# EAGLE design MOD-X_V10 (EAGLE 9.6.2)

## Sheet 1 of 2
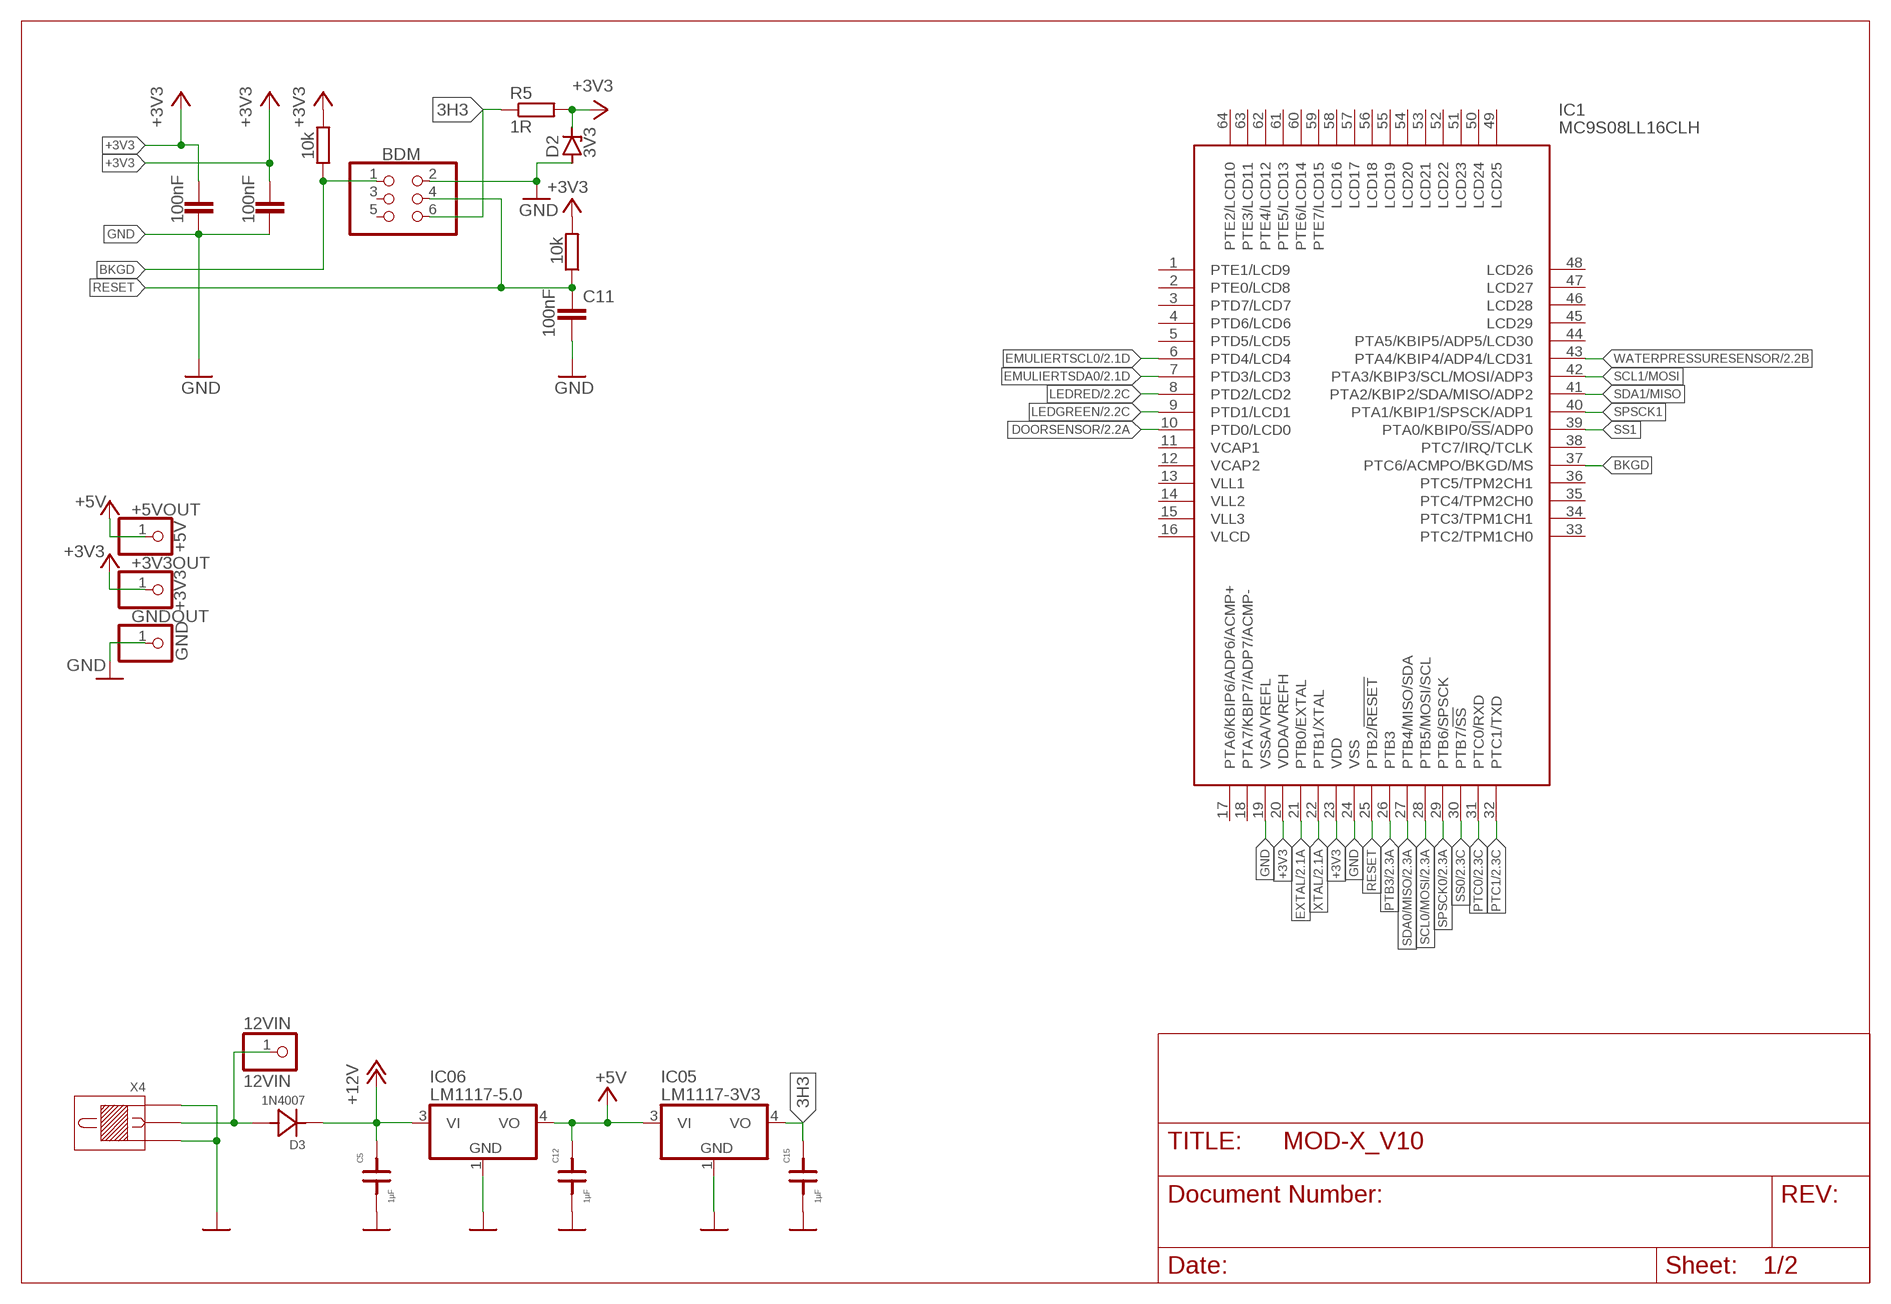
[diagram p0: schematic, sheet 1]

### Parts
12VIN  12VIN  PINHD-1X1  [1X01]
+3V3OUT  +3V3  PINHD-1X1  [1X01]
+5VOUT  +5V  PINHD-1X1  [1X01]
BDM  PINHD-2X3  [2X03]
C5  1µF  C1  [0805F]
C9  100nF  C-EUC0805  [C0805]
C10  100nF  C-EUC0805  [C0805]
C11  100nF  C-EUC0805  [C0805]
C12  1µF  C1  [0805F]
C15  1µF  C1  [0805F]
D2  3V3  ZENER-DIODESOD80C  [SOD80C]
D3  1N4007  DHCMELF  [MELF_B]
GNDOUT  GND  PINHD-1X1  [1X01]
IC1  MC9S08LL16CLH  [QFP50P1200X1200X160-64N]
IC05  LM1117-3V3  LM1117DT  [DPAK]
IC06  LM1117-5.0  LM1117DT  [DPAK]
R5  1R  R-EU_R0805  [R0805]
R16  10k  R-EU_R0805  [R0805]
R17  10k  R-EU_R0805  [R0805]
X4  SPP  [SPP]

### Nets
3H3: BDM.6 C15.2 IC05.4(VO) R5.1
+3V3: +3V3OUT.1 C9.1 C10.1 D2.C IC1.20(VDDA/VREFH) IC1.23(VDD) R5.2 R16.2 R17.2 ; also sheet 2
+5V: +5VOUT.1 C12.2 IC05.3(VI) IC06.4(VO) ; also sheet 2
+12V: C5.2 D3.K IC06.3(VI) ; also sheet 2
BKGD: BDM.1 IC1.37(PTC6/ACMPO/BKGD/MS) R16.1
DOORSENSOR: IC1.10(PTD0/LCD0) ; also sheet 2
EMULIERTSCL0: IC1.6(PTD4/LCD4) ; also sheet 2
EMULIERTSDA0: IC1.7(PTD3/LCD3) ; also sheet 2
EXTAL: IC1.21(PTB0/EXTAL) ; also sheet 2
GND: BDM.2 C5.1 C9.2 C10.2 C11.2 C12.1 C15.1 D2.A GNDOUT.1 IC1.19(VSSA/VREFL) IC1.24(VSS) IC05.1(GND) IC06.1(GND) X4.1 X4.3 ; also sheet 2
LEDGREEN: IC1.9(PTD1/LCD1) ; also sheet 2
LEDRED: IC1.8(PTD2/LCD2) ; also sheet 2
N$71: 12VIN.1 D3.A X4.2
PTB3: IC1.26(PTB3) ; also sheet 2
PTC0: IC1.31(PTC0/RXD) ; also sheet 2
PTC1: IC1.32(PTC1/TXD) ; also sheet 2
RESET: BDM.4 C11.1 IC1.25(PTB2/!RESET) R17.1
SCL0/MOSI: IC1.28(PTB5/MOSI/SCL) ; also sheet 2
SCL1/MOSI: IC1.42(PTA3/KBIP3/SCL/MOSI/ADP3)
SDA0/MISO: IC1.27(PTB4/MISO/SDA) ; also sheet 2
SDA1/MISO: IC1.41(PTA2/KBIP2/SDA/MISO/ADP2)
SPSCK0: IC1.29(PTB6/SPSCK) ; also sheet 2
SPSCK1: IC1.40(PTA1/KBIP1/SPSCK/ADP1)
SS0: IC1.30(PTB7/!SS) ; also sheet 2
SS1: IC1.39(PTA0/KBIP0/!SS!/ADP0)
WATERPRESSURESENSOR: IC1.43(PTA4/KBIP4/ADP4/LCD31) ; also sheet 2
XTAL: IC1.22(PTB1/XTAL) ; also sheet 2
Unconnected: BDM.3 BDM.5 IC1.1(PTE1/LCD9) IC1.2(PTE0/LCD8) IC1.3(PTD7/LCD7) IC1.4(PTD6/LCD6) IC1.5(PTD5/LCD5) IC1.11(VCAP1) IC1.12(VCAP2) IC1.13(VLL1) IC1.14(VLL2) IC1.15(VLL3) IC1.16(VLCD) IC1.17(PTA6/KBIP6/ADP6/ACMP+) IC1.18(PTA7/KBIP7/ADP7/ACMP-) IC1.33(PTC2/TPM1CH0) IC1.34(PTC3/TPM1CH1) IC1.35(PTC4/TPM2CH0) IC1.36(PTC5/TPM2CH1) IC1.38(PTC7/IRQ/TCLK) IC1.44(PTA5/KBIP5/ADP5/LCD30) IC1.45(LCD29) IC1.46(LCD28) IC1.47(LCD27) IC1.48(LCD26) IC1.49(LCD25) IC1.50(LCD24) IC1.51(LCD23) IC1.52(LCD22) IC1.53(LCD21) IC1.54(LCD20) IC1.55(LCD19) IC1.56(LCD18) IC1.57(LCD17) IC1.58(LCD16) IC1.59(PTE7/LCD15) IC1.60(PTE6/LCD14) IC1.61(PTE5/LCD13) IC1.62(PTE4/LCD12) IC1.63(PTE3/LCD11) IC1.64(PTE2/LCD10)

## Sheet 2 of 2
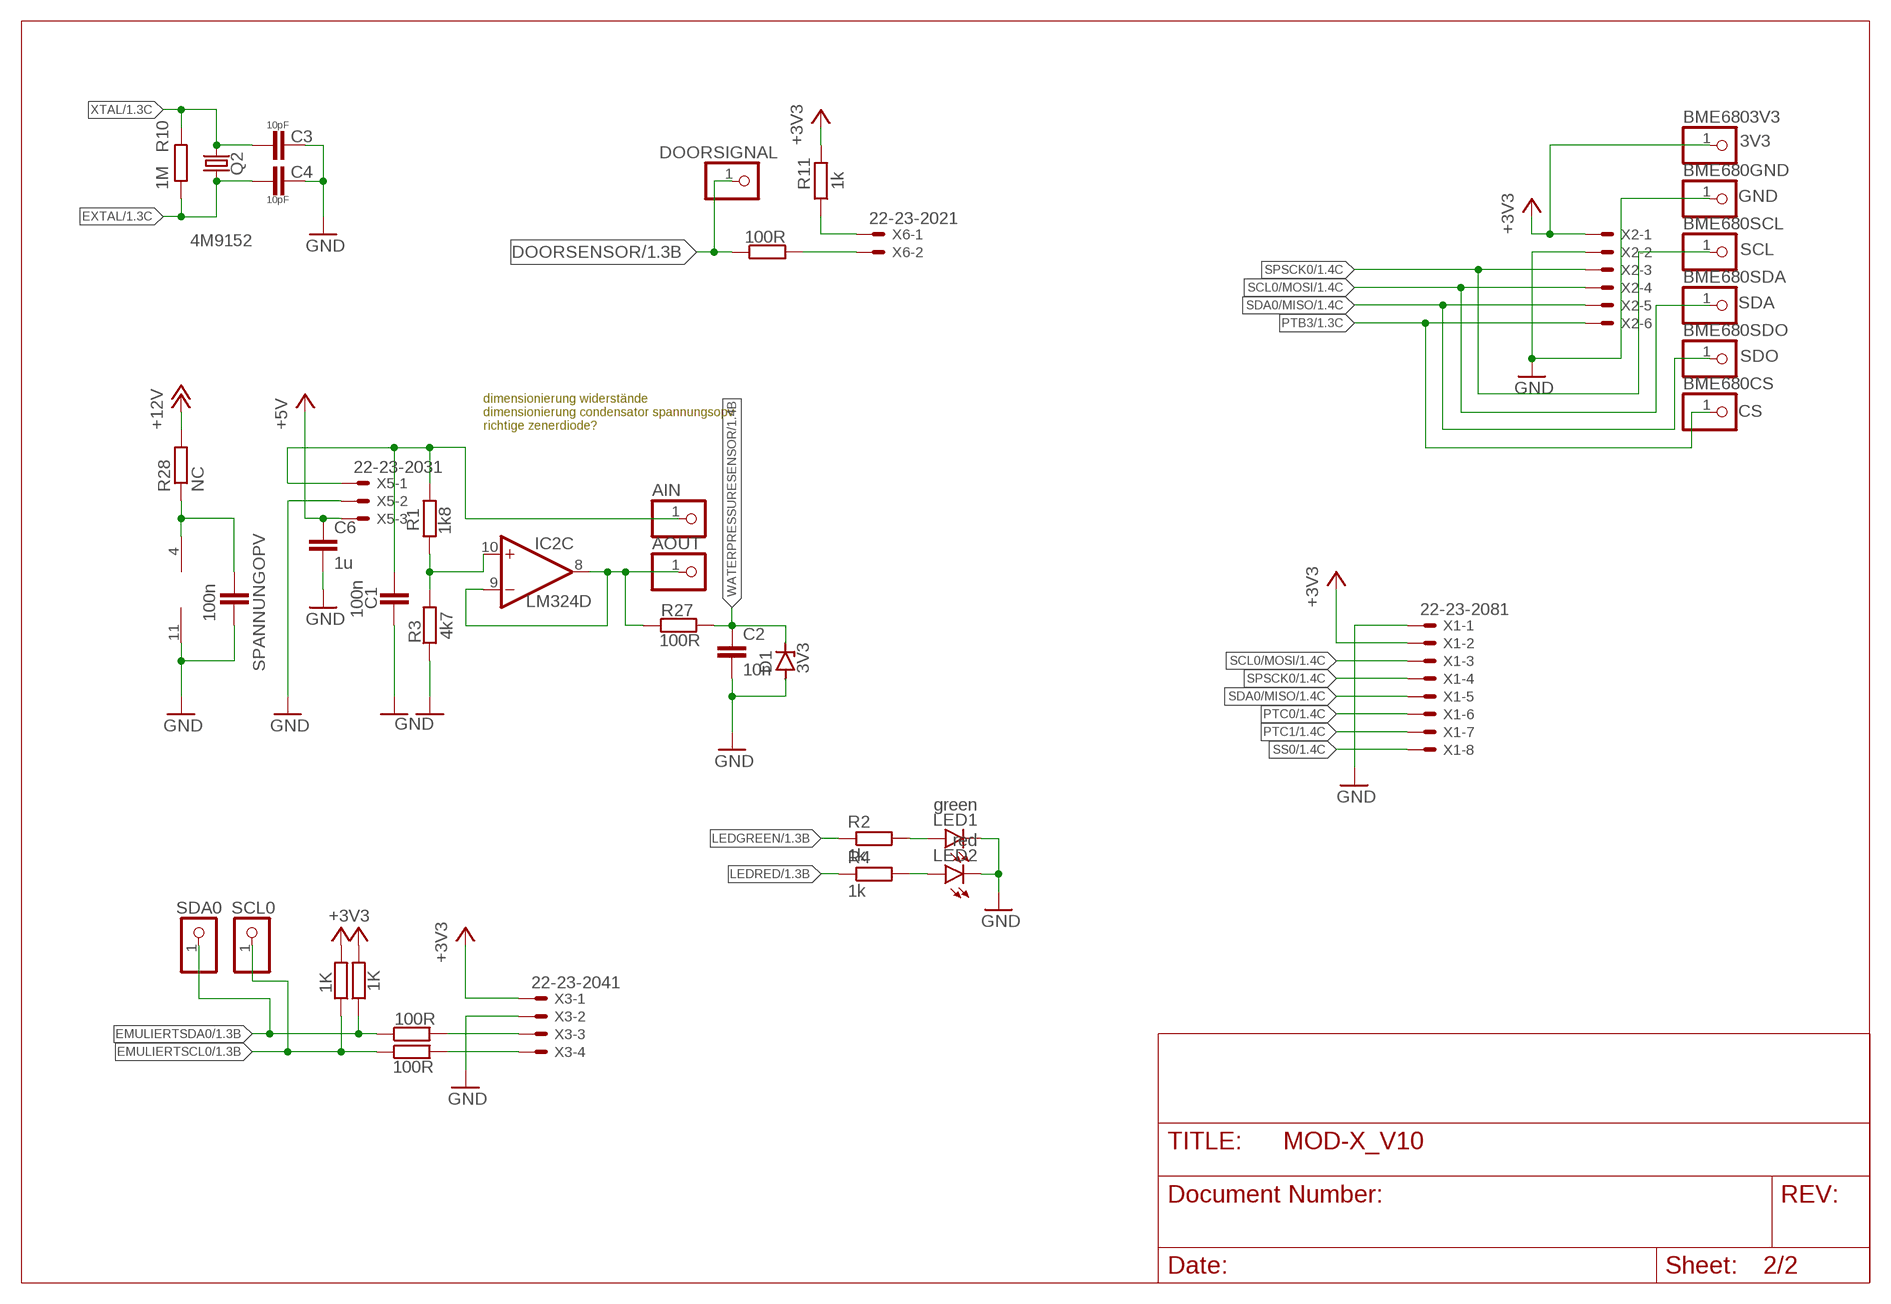
[diagram p1: schematic, sheet 2]

### Parts
AIN  PINHD-1X1  [1X01]
AOUT  PINHD-1X1  [1X01]
BME680CS  CS  PINHD-1X1  [1X01]
BME680GND  GND  PINHD-1X1  [1X01]
BME680SCL  SCL  PINHD-1X1  [1X01]
BME680SDA  SDA  PINHD-1X1  [1X01]
BME680SDO  SDO  PINHD-1X1  [1X01]
BME6803V3  3V3  PINHD-1X1  [1X01]
C1  100n  C-EUC0805  [C0805]
C2  10n  C-EUC0805  [C0805]
C3  10pF  C-EUC0805  [C0805]
C4  10pF  C-EUC0805  [C0805]
C6  1u  C-EUC0805  [C0805]
D1  3V3  ZENER-DIODESOD80C  [SOD80C]
DOORSIGNAL  PINHD-1X1  [1X01]
IC2  LM324D  [SO14]
LED1  green  LEDCHIP-LED0805  [CHIP-LED0805]
LED2  red  LEDCHIP-LED0805  [CHIP-LED0805]
Q2  4M9152  CRYSTALHC49UP  [HC49UP]
R1  1k8  R-EU_R0805  [R0805]
R2  1k  R-EU_R0805  [R0805]
R3  4k7  R-EU_R0805  [R0805]
R4  1k  R-EU_R0805  [R0805]
R6  100R  R-EU_R0805  [R0805]
R7  100R  R-EU_R0805  [R0805]
R8  100R  R-EU_R0805  [R0805]
R9  1K  R-EU_R0805  [R0805]
R10  1M  R-EU_R0805  [R0805]
R11  1k  R-EU_R0805  [R0805]
R18  1K  R-EU_R0805  [R0805]
R27  100R  R-EU_R0805  [R0805]
R28  NC  R-EU_R0805  [R0805]
SCL0  PINHD-1X1  [1X01]
SDA0  PINHD-1X1  [1X01]
SPANNUNGOPV  100n  C-EUC0805  [C0805]
X1  22-23-2081  [22-23-2081]
X2  22-23-2061  [22-23-2061]
X3  22-23-2041  [22-23-2041]
X5  22-23-2031  [22-23-2031]
X6  22-23-2021  [22-23-2021]

### Nets
+3V3: BME6803V3.1 R9.2 R11.2 R18.2 X1.2 X2.1 X3.1 ; also sheet 1
+5V: C6.1 X5.3 ; also sheet 1
+12V: R28.2 ; also sheet 1
DOORSENSOR: DOORSIGNAL.1 R6.1 ; also sheet 1
EMULIERTSCL0: R8.1 R18.1 SCL0.1 ; also sheet 1
EMULIERTSDA0: R7.1 R9.1 SDA0.1 ; also sheet 1
EXTAL: C4.1 Q2.1 R10.1 ; also sheet 1
GND: BME680GND.1 C1.2 C2.2 C3.2 C4.2 C6.2 D1.A IC2.11(P:V-) LED1.C LED2.C R3.1 SPANNUNGOPV.2 X1.1 X2.2 X3.2 X5.2 ; also sheet 1
LEDGREEN: R2.1 ; also sheet 1
LEDRED: R4.1 ; also sheet 1
N$2: IC2.10(C:+IN) R1.1 R3.2
N$3: AIN.1 C1.1 R1.2 X5.1
N$4: R6.2 X6.2
N$6: R11.1 X6.1
N$7: IC2.4(P:V+) R28.1 SPANNUNGOPV.1
N$9: LED1.A R2.2
N$10: R8.2 X3.4
N$11: R7.2 X3.3
N$12: LED2.A R4.2
N$21: AOUT.1 IC2.8(C:OUT) IC2.9(C:-IN) R27.1
PTB3: BME680CS.1 X2.6 ; also sheet 1
PTC0: X1.6 ; also sheet 1
PTC1: X1.7 ; also sheet 1
SCL0/MOSI: BME680SDA.1 X1.3 X2.4 ; also sheet 1
SDA0/MISO: BME680SDO.1 X1.5 X2.5 ; also sheet 1
SPSCK0: BME680SCL.1 X1.4 X2.3 ; also sheet 1
SS0: X1.8 ; also sheet 1
WATERPRESSURESENSOR: C2.1 D1.C R27.2 ; also sheet 1
XTAL: C3.1 Q2.2 R10.2 ; also sheet 1
Unconnected: IC2.1(A:OUT) IC2.2(A:-IN) IC2.3(A:+IN) IC2.5(B:+IN) IC2.6(B:-IN) IC2.7(B:OUT) IC2.12(D:+IN) IC2.13(D:-IN) IC2.14(D:OUT)

### Notes on the sheet
- dimensionierung widerstände
  dimensionierung condensator spannungsopv
  richtige zenerdiode?

## Library data of the parts
12VIN +3V3OUT +5VOUT AIN AOUT BME680CS BME680GND BME680SCL BME680SDA BME680SDO BME6803V3 DOORSIGNAL GNDOUT SCL0 SDA0 = pinhead:PINHD-1X1: PIN HEADER
BDM = pinhead:PINHD-2X3: PIN HEADER
C1-C4 C6 C9-C11 SPANNUNGOPV = rcl:C-EU: CAPACITOR, European symbol; SPICEPREFIX: C
C5 C12 C15 = deto:C
D1 D2 = diode:ZENER-DIODE: Z-Diode
D3 = deto:DHC: Hii-Curr-Diode, Silizium, Typ Gleichrichter z.B. wie 1N4007 oder ähnlich
IC1 = MC9S08LL16CLH:MC9S08LL16CLH: MCU 8-bit S08 CISC 16KB Flash 2.5V/3.3V 64-Pin LQFP Tray Source: Datasheet <http://www.nxp.com/docs/en/data-sheet/MC9S08LL16.pdf>; ARROW_PART_NUMBER: MC9S08LL16CLH; ARROW_PRICE-STOCK: https://www.arrow.com/en/products/mc9s08ll16clh/nxp-semiconductors; DESCRIPTION: MCU 8-bit S08 CISC 16KB Flash 2.5V/3.3V 64-Pin LQFP Tray; HEIGHT: 1.6mm; MANUFACTURER_NAME: NXP; MANUFACTURER_PART_NUMBER: MC9S08LL16CLH; MOUSER_PART_NUMBER: 841-MC9S08LL16CLH; MOUSER_PRICE-STOCK: https://www.mouser.com/Search/Refine.aspx?Keyword=841-MC9S08LL16CLH
IC2 = linear:LM324: OP AMP
IC05 IC06 = deto:LM1117: Spannungsregler Fix oder einstellbar LM1117XX-YY wobei XX die Gehäuseform angibt (DT = Dpak) und YY die Spannung angibt (z.B. 5.0 für 5V oder ADJ für einstellbar)
LED1 LED2 = led:LED: LED OSRAM: - CHIPLED LG R971, LG N971, LY N971, LG Q971, LY Q971, LO R971, LY R971 LH N974, LH R974 LS Q976, LO Q976, LY Q976 LO Q996 - Hyper CHIPLED LW Q18S LB Q993, LB Q99A, LB R99A - SideLED LS A670, LO A670, LY A670, LG A670, LP A670 LB A673, LV A673, LT A673, LW A673 LH A674 LY A675 LS A676, LA A676, LO A676, LY A676, LW A676 LS A679, LY A679, LG A679 - Hyper Micro SIDELED® LS Y876, LA Y876, LO Y876, LY Y876 LT Y87S - SmartLED LW L88C, LW L88S LB L89C, LB L89S, LG L890 LS L89K, LO L89K, LY L89K LS L896, LA L896, LO L896, LY L896 - TOPLED LS T670, LO T670, LY T670, LG T670, LP T670 LSG T670, LSP T670, LSY T670, LOP T670, LYG T670 LG T671, LOG T671, LSG T671 LB T673, LV T673, LT T673, LW T673 LH T674 LS T676, LA T676, LO T676, LY T676, LB T676, LH T676, LSB T676, LW T676 LB T67C, LV T67C, LT T67C, LS T67K, LO T67K, LY T67K, LW E67C LS E67B, LA E67B, LO E67B, LY E67B, LB E67C, LV E67C, LT E67C LW T67C LS T679, LY T679, LG T679 LS T770, LO T770, LY T770, LG T770, LP T770 LB T773, LV T773, LT T773, LW T773 LH T774 LS E675, LA E675, LY E675, LS T675 LS T776, LA T776, LO T776, LY T776, LB T776 LHGB T686 LT T68C, LB T68C - Hyper Mini TOPLED® LB M676 - Mini TOPLED Santana® LG M470 LS M47K, LO M47K, LY M47K Source: http://www.osram.convergy.de LUXEON: - LUMILED® LXK2-PW12-R00, LXK2-PW12-S00, LXK2-PW14-U00, LXK2-PW14-V00 LXK2-PM12-R00, LXK2-PM12-S00, LXK2-PM14-U00 LXK2-PE12-Q00, LXK2-PE12-R00, LXK2-PE12-S00, LXK2-PE14-T00, LXK2-PE14-U00 LXK2-PB12-K00, LXK2-PB12-L00, LXK2-PB12-M00, LXK2-PB14-N00, LXK2-PB14-P00, LXK2-PB14-Q00 LXK2-PR12-L00, LXK2-PR12-M00, LXK2-PR14-Q00, LXK2-PR14-R00 LXK2-PD12-Q00, LXK2-PD12-R00, LXK2-PD12-S00 LXK2-PH12-R00, LXK2-PH12-S00 LXK2-PL12-P00, LXK2-PL12-Q00, LXK2-PL12-R00 Source: www.luxeon.com KINGBRIGHT: KA-3528ASYC Source: www.kingbright.com
Q2 = crystal:CRYSTAL: CRYSTAL; OC_FARNELL: unknown; OC_NEWARK: unknown
R1-R11 R16-R18 R27 R28 = rcl:R-EU_: RESISTOR, European symbol; SPICEPREFIX: R
X1 = con-molex:22-23-2081: .100" (2.54mm) Center Header - 8 Pin; MF: MOLEX; MPN: 22-23-2081; OC_FARNELL: 1756826; OC_NEWARK: 01C7592
X2 = con-molex:22-23-2061: .100" (2.54mm) Center Header - 6 Pin; MF: MOLEX; MPN: 22-23-2061; OC_FARNELL: 1462922; OC_NEWARK: 27C1933
X3 = con-molex:22-23-2041: .100" (2.54mm) Center Header - 4 Pin; MF: MOLEX; MPN: 22-23-2041; OC_FARNELL: 1462920; OC_NEWARK: 38C0355
X4 = CONNECT:SPP
X5 = con-molex:22-23-2031: .100" (2.54mm) Center Header - 3 Pin; MF: MOLEX; MPN: 22-23-2031; OC_FARNELL: 1462950; OC_NEWARK: 30C0862
X6 = con-molex:22-23-2021: .100" (2.54mm) Center Header - 2 Pin; MF: MOLEX; MPN: 22-23-2021; OC_FARNELL: 1462926; OC_NEWARK: 25C3832

## Board
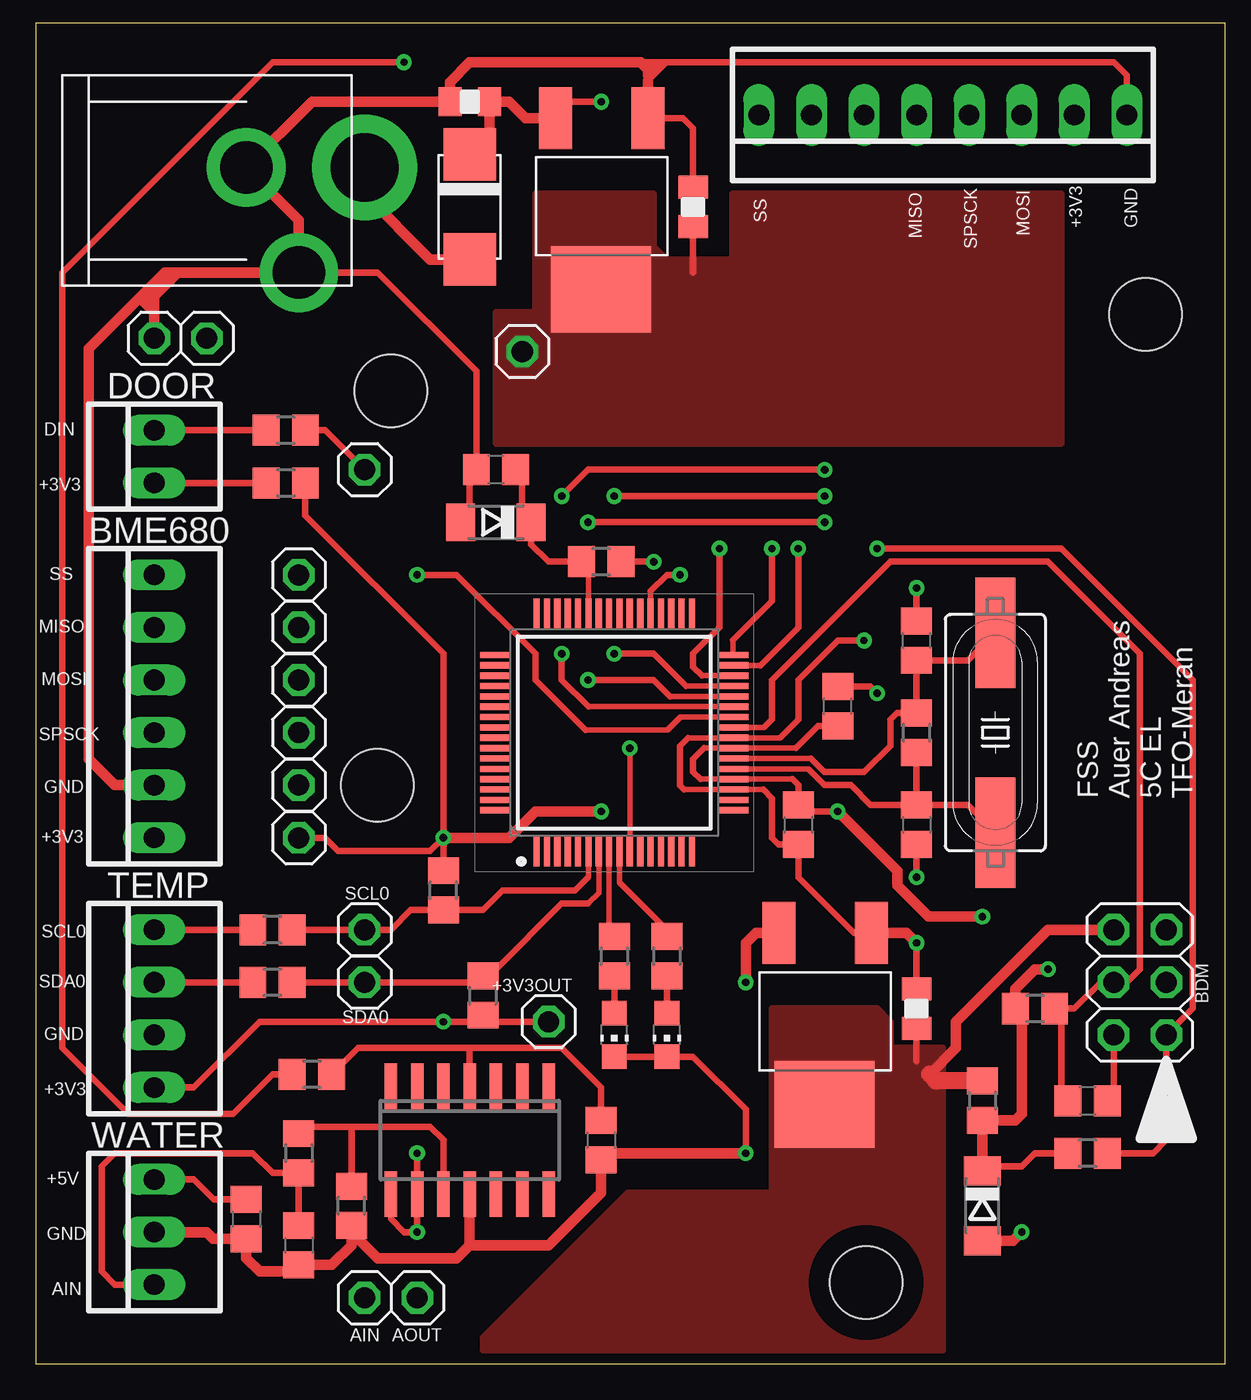
[diagram p2: board, top side]
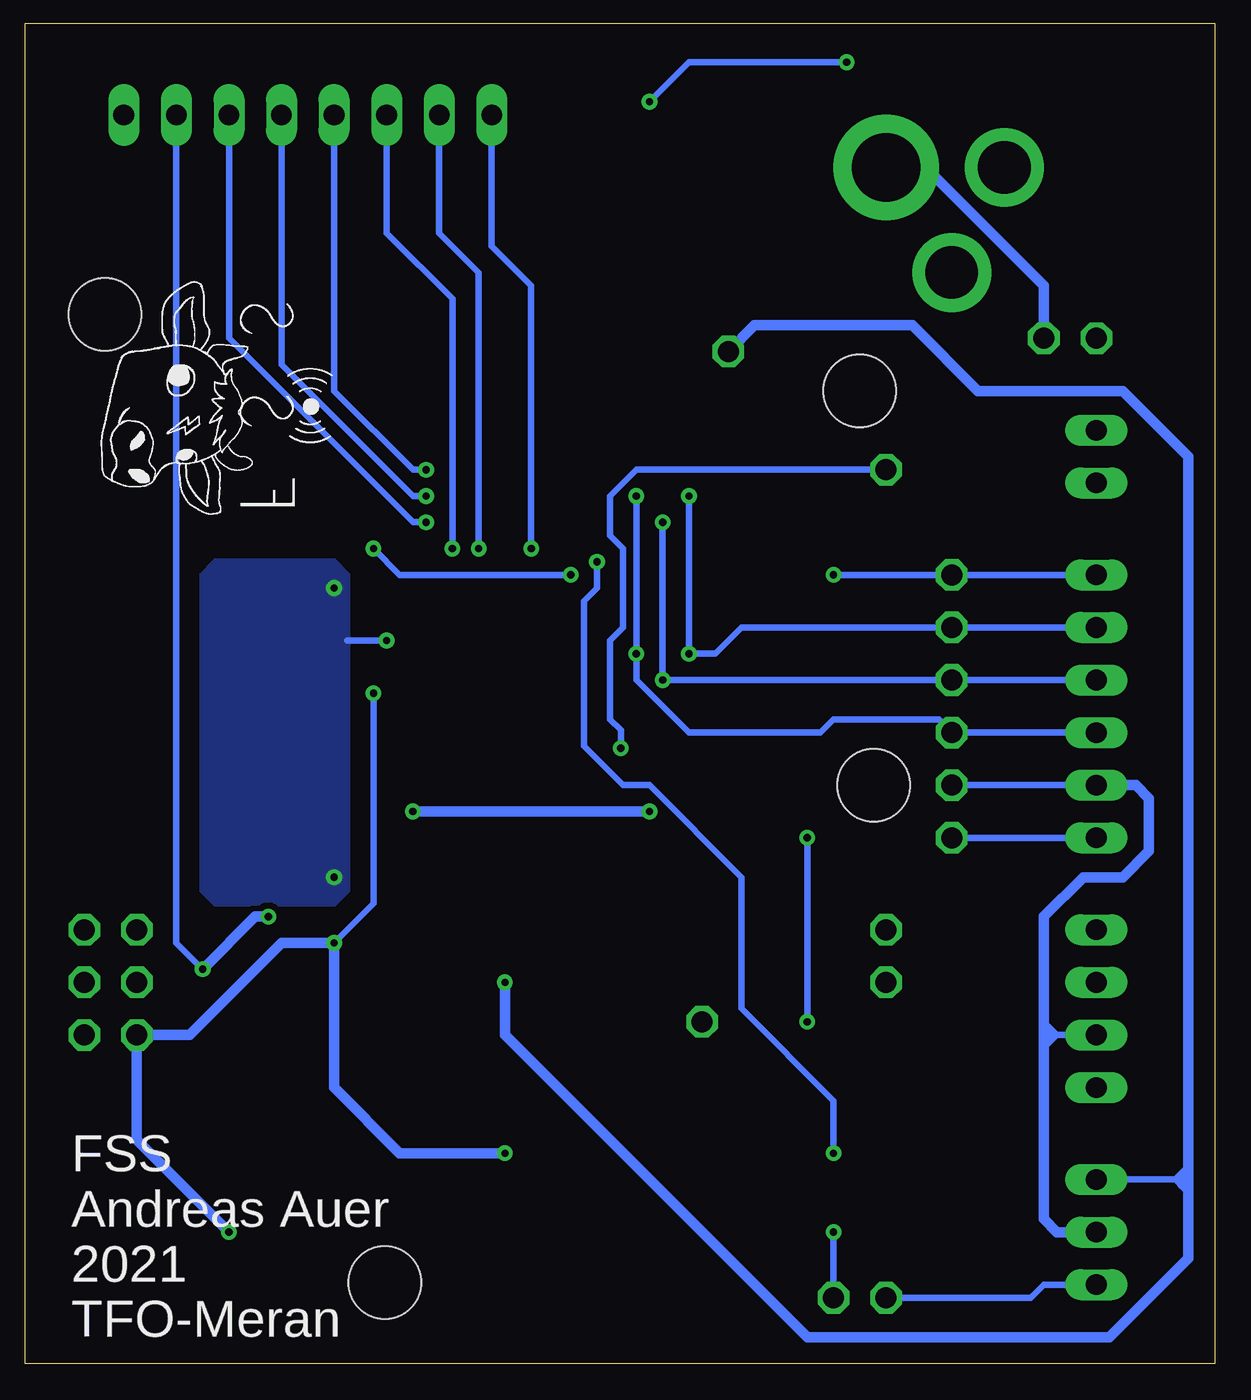
[diagram p3: board, bottom side, seen from below]

No outline drawn. Coordinates in mm, seen from the top.
Copper layers (1*16): Top 0.035mm / dielectric 1.5mm / Bottom 0.035mm
Design rules "default *": minimum track width 6mil, minimum drill 0.35mm, track to track 12mil, track to pad 12mil, pad to pad 12mil, via to via 12mil, smd to smd 12mil, copper to edge 40mil, drill to drill 12mil, minimum pad ring 10mil, minimum via ring 8mil, stop-mask expansion 4mil, vias tented up to drill 0mil, thermal gap 10mil
Holes 3.5 mm at 16.48,27.94 53.62,50.69 17.14,46.99 40.1,3.92
Milling: 4 lines

### Footprints (pad centres in the part's own frame; a part is rotated, then mirrored left to right if it is on the bottom)
1X01 = drill 1.016 octagon: 1 0,0
2X03 = drill 1.016 octagon: 1 -2.54,-1.27; 2 -2.54,1.27; 3 0,-1.27; 4 0,1.27; 5 2.54,-1.27; 6 2.54,1.27
C0805 = smd 1.3 x 1.5: 1 -0.95,0; 2 0.95,0
0805F = smd 1.118 x 1.422: 1 -0.953,0; 2 0.953,0
SOD80C = smd 1.4 x 1.8: A 1.7,0; C -1.7,0
MELF_B = smd 2.54 x 2.54: A 2.54,0; K -2.54,0
QFP50P1200X1200X160-64N = smd 1.475 x 0.3: 1 -5.738,3.75; 2 -5.738,3.25; 3 -5.738,2.75; 4 -5.738,2.25; 5 -5.738,1.75; 6 -5.738,1.25; 7 -5.738,0.75; 8 -5.738,0.25; 9 -5.738,-0.25; 10 -5.738,-0.75; 11 -5.738,-1.25; 12 -5.738,-1.75; 13 -5.738,-2.25; 14 -5.738,-2.75; 15 -5.738,-3.25; 16 -5.738,-3.75; 33 5.738,-3.75; 34 5.738,-3.25; 35 5.738,-2.75; 36 5.738,-2.25; 37 5.738,-1.75; 38 5.738,-1.25; 39 5.738,-0.75; 40 5.738,-0.25; 41 5.738,0.25; 42 5.738,0.75; 43 5.738,1.25; 44 5.738,1.75; 45 5.738,2.25; 46 5.738,2.75; 47 5.738,3.25; 48 5.738,3.75 | smd 0.3 x 1.475: 17 -3.75,-5.738; 18 -3.25,-5.738; 19 -2.75,-5.738; 20 -2.25,-5.738; 21 -1.75,-5.738; 22 -1.25,-5.738; 23 -0.75,-5.738; 24 -0.25,-5.738; 25 0.25,-5.738; 26 0.75,-5.738; 27 1.25,-5.738; 28 1.75,-5.738; 29 2.25,-5.738; 30 2.75,-5.738; 31 3.25,-5.738; 32 3.75,-5.738; 49 3.75,5.738; 50 3.25,5.738; 51 2.75,5.738; 52 2.25,5.738; 53 1.75,5.738; 54 1.25,5.738; 55 0.75,5.738; 56 0.25,5.738; 57 -0.25,5.738; 58 -0.75,5.738; 59 -1.25,5.738; 60 -1.75,5.738; 61 -2.25,5.738; 62 -2.75,5.738; 63 -3.25,5.738; 64 -3.75,5.738
SO14 = smd 0.6 x 2.2: 1 -3.81,-2.6; 2 -2.54,-2.6; 3 -1.27,-2.6; 4 0,-2.6; 5 1.27,-2.6; 6 2.54,-2.6; 7 3.81,-2.6; 8 3.81,2.6; 9 2.54,2.6; 10 1.27,2.6; 11 0,2.6; 12 -1.27,2.6; 13 -2.54,2.6; 14 -3.81,2.6
DPAK = smd 1.6 x 2.997: 1 -2.261,-3.658; 3 2.21,-3.658 | smd 4.826 x 4.191: 4 0,4.623
CHIP-LED0805 = smd 1.2 x 1.2: A 0,-1.05; C 0,1.05
HC49UP = smd 5.334 x 1.93: 1 -4.826,0; 2 4.826,0
R0805 = smd 1.3 x 1.5: 1 -0.95,0; 2 0.95,0
22-23-2081 = drill 1 long: 1 -8.89,0; 2 -6.35,0; 3 -3.81,0; 4 -1.27,0; 5 1.27,0; 6 3.81,0; 7 6.35,0; 8 8.89,0
22-23-2061 = drill 1 long: 1 -6.35,0; 2 -3.81,0; 3 -1.27,0; 4 1.27,0; 5 3.81,0; 6 6.35,0
22-23-2041 = drill 1 long: 1 -3.81,0; 2 -1.27,0; 3 1.27,0; 4 3.81,0
SPP = drill 2.54 pad 3.81: 1 0,0; 3 -2.54,5.08 | drill 3.302 pad 5.08: 2 -5.715,0
22-23-2031 = drill 1 long: 1 -2.54,0; 2 0,0; 3 2.54,0
22-23-2021 = drill 1 long: 1 -1.27,0; 2 1.27,0

### Placement (x,y rotation side)
12VIN  8.26,49.53 0 top
+3V3OUT  24.77,16.51 0 top
+5VOUT  23.5,48.9 0 top
AIN  15.88,3.17 0 top
AOUT  18.41,3.17 0 top
BDM  53.34,18.41 90 top
BME680CS  12.7,38.1 0 top
BME680GND  12.7,27.94 0 top
BME680SCL  12.7,30.48 0 top
BME680SDA  12.7,33.02 0 top
BME680SDO  12.7,35.56 0 top
BME6803V3  12.7,25.4 0 top
C1  12.7,5.71 270 top
C2  22.23,43.18 180 top
C3  42.55,34.92 90 top
C4  42.55,26.04 270 top
C5  20.95,60.96 0 top
C6  10.16,6.99 270 top
C9  38.73,31.75 90 top
C10  36.83,26.04 270 top
C11  50.8,12.7 0 top
C12  31.75,55.88 270 top
C15  42.55,17.14 270 top
D1  22.23,40.64 180 top
D2  45.72,7.62 270 top
D3  20.95,55.88 270 top
DOORSIGNAL  15.88,43.18 0 top
GNDOUT  5.71,49.53 0 top
IC1  27.94,30.48 90 top
IC2  20.95,10.79 180 top
IC05  38.1,17.14 180 top
IC06  27.3,56.52 180 top
LED1  30.48,15.88 180 top
LED2  27.94,15.88 180 top
Q2  46.35,30.48 90 top
R1  12.7,10.16 270 top
R2  30.48,19.68 270 top
R3  15.24,7.62 90 top
R4  27.94,19.68 270 top
R5  45.72,12.7 270 top
R6  12.06,45.09 180 top
R7  11.43,18.41 180 top
R8  11.43,20.95 180 top
R9  21.59,17.78 270 top
R10  42.55,30.48 90 top
R11  12.06,42.55 0 top
R16  50.8,10.16 180 top
R17  48.26,17.14 180 top
R18  19.68,22.86 90 top
R27  27.3,38.73 180 top
R28  13.34,13.97 180 top
SCL0  15.88,20.95 0 top
SDA0  15.88,18.41 0 top
SPANNUNGOPV  27.3,10.79 270 top
X1  43.81,60.33 180 top
X2  5.71,31.75 90 top
X3  5.71,17.14 90 top
X4  10.16,57.78 180 top
X5  5.71,6.35 90 top
X6  5.71,43.81 90 top

### Tracks (layer width: path | path; a pad name or v marks a point on that pad's centre or on a via)
3H3
  Top 0.305: C15.2 42.55,14.61
  Top 0.508: BDM.6 48.9,20.95 44.45,16.51 44.45,15.24 43.18,13.97
  Top 0.813: R5.1 43.5,13.65 43.18,13.97
  pour Top (no thermals): 35.56,17.14 35.56,8.26 28.57,8.26 21.59,1.27 21.59,0.64 43.81,0.64 43.81,15.24 41.27,15.24 41.27,16.51 40.64,17.14
+3V3  (via drill 0.35)
  Top 0.254: 32.27,29.73 IC1.23 36.72,29.73 | 32.09,28.23 IC1.20 36.54,28.23
  Top 0.305: R11.2 13.02,40.96 19.68,34.29 v19.68,25.4 | R18.2 v19.68,25.4 | v38.73,26.67 37.15,26.67 C10.1 36.83,27.94 36.54,28.23 | 32.27,29.73 31.75,29.21 31.75,28.57 32.09,28.23 | X3.1 7.62,13.34 10.79,16.51 v19.68,16.51 21.27,16.51 R9.2 21.91,16.51 +3V3OUT.1 | C9.1 37.78,30.8 36.72,29.73 | D2.C 45.92,9.53 47.62,9.53 48.26,10.16 R16.2 | BME6803V3.1 13.97,25.4 14.61,24.77 19.05,24.77 v19.68,25.4
  Top 0.508: v19.68,25.4 22.86,25.4 24.13,26.67 v27.3,26.67 | D2.C R5.2 47.31,11.75 47.62,12.06 47.62,16.83 R17.2 47.31,18.1 48.26,19.05 v48.9,19.05 | v38.73,26.67 41.61,23.8 41.61,23.11 43.12,21.59 v45.72,21.59
  Bottom 0.305: BME6803V3.1 X2.1 | v19.68,16.51 v19.68,25.4 | v48.9,19.05 50.16,20.32 X1.2
  Bottom 0.508: v27.3,26.67 v38.73,26.67 | v48.9,19.05 46.35,21.59 v45.72,21.59
+5V  (via drill 0.35)
  Top 0.305: C12.2 31.75,52.7 | X5.3 7.62,8.89 8.57,7.93 C6.1
  Top 0.508: IC05.3 34.77,20.8 34.29,20.32 v34.29,18.41
  Bottom 0.305: X5.3 1.91,8.89 | 1.91,8.89 1.27,9.53 1.27,9.4 1.78,8.89 | 1.91,8.89 1.71,8.7 | 1.65,8.64 1.52,8.51 | 1.52,8.51 1.46,8.45 | 1.46,8.45 1.27,8.26 | 1.27,9.27 1.27,9.14 1.52,8.89 | 1.46,8.45 1.27,8.64 1.65,8.64 | 1.52,8.51 1.52,8.64 1.27,8.89 1.4,8.89 | 1.52,8.89 1.71,8.7 | 1.71,8.7 1.65,8.64 | 1.52,8.89 1.65,8.89 1.78,8.89 | 1.91,8.89 1.78,8.89 | 1.52,8.89 1.4,8.89 | 1.4,8.89 1.27,9.02 | 1.4,8.89 1.65,8.64
  Bottom 0.508: +5VOUT.1 22.23,50.16 14.61,50.16 11.43,46.99 4.45,46.99 1.27,43.81 1.27,9.53 | 1.27,9.4 1.27,9.27 1.65,8.89 | 1.27,9.14 1.27,9.02 1.27,8.89 1.27,8.64 1.27,8.26 1.27,5.08 5.08,1.27 19.68,1.27 34.29,15.88 v34.29,18.41
  pour Top (no thermals): 29.84,56.52 24.13,56.52 24.13,50.8 22.23,50.8 22.23,44.45 49.53,44.45 49.53,56.52 33.66,56.52 33.66,53.34 30.48,53.34 29.84,53.98
+12V  (via drill 0.35)
  Top 0.305: R28.2 11.43,13.97 9.53,12.06 4.45,12.06 1.27,15.24 1.27,52.7 11.43,62.87 v17.78,62.87 | v27.3,60.96 25.4,60.96 25.09,60.66 IC06.3
  Top 0.508: IC06.3 23.65,60.17 22.86,60.96 C5.2 21.91,59.37 D3.K
  Bottom 0.305: v17.78,62.87 25.4,62.87 v27.3,60.96
BKGD  (via drill 0.35)
  Top 0.254: IC1.37 29.69,37.31
  Top 0.305: 29.69,37.31 30.48,38.1 v31.11,38.1 | R16.1 53.98,10.16 54.61,10.79 BDM.1 55.88,17.14 55.88,33.02 49.53,39.37 v40.64,39.37
  Bottom 0.305: v40.64,39.37 39.37,38.1 v31.11,38.1
DOORSENSOR  (via drill 0.35)
  Top 0.254: v28.69,29.73 IC1.10
  Top 0.305: R6.1 13.97,45.09 DOORSIGNAL.1
  Bottom 0.305: v28.69,29.73 28.69,30.59 29.21,31.11 29.21,34.92 28.57,35.56 28.57,39.37 29.21,40.01 29.21,41.91 27.94,43.18 DOORSIGNAL.1
EMULIERTSCL0
  Top 0.254: IC1.6 26.69,23.52 26.04,22.86
  Top 0.305: R8.1 SCL0.1 17.14,20.95 18.1,21.91 R18.1 21.59,21.91 22.54,22.86 26.04,22.86
EMULIERTSDA0
  Top 0.254: IC1.7 27.19,22.75 26.67,22.23
  Top 0.305: R7.1 SDA0.1 21.27,18.41 R9.1 21.91,19.05 22.23,19.05 25.4,22.23 26.67,22.23
EXTAL
  Top 0.254: IC1.21 37.31,28.73 38.1,27.94
  Top 0.305: C4.1 45.02,26.98 Q2.1 | R10.1 C4.1 | 38.1,27.94 39.37,27.94 40.33,26.98 C4.1
GND  (via drill 0.35)
  Top 0.254: 31.5,30.23 IC1.24 35.95,30.23 36.83,31.11 | 35.13,27.73 IC1.19 31.31,27.73
  Top 0.305: 19.68,60.96 C5.1 | IC06.1 31.27,60.17 31.75,59.69 C12.1 | C3.2 v42.55,37.47 | IC05.1 40.64,20.8 40.64,21.08 IC05.1 | v42.55,20.32 C15.1 | 35.13,27.73 35.56,27.3 35.56,25.4 35.88,25.09 C10.2 36.83,23.5 39.52,20.8 IC05.1 | 31.5,30.23 31.11,29.84 31.11,27.93 31.31,27.73 | BDM.2 52.07,13.02 C11.2 | C4.2 v42.55,23.5 | 30.45,62.87 52.07,62.87 52.7,62.23 X1.1 | 30.45,62.87 30.2,62.87 | 30.2,62.87 29.57,62.23 29.57,61.98 30.45,62.87 | 29.92,62.87 29.21,62.87 | 30.2,62.87 29.92,62.87 | 29.92,62.87 29.57,62.51 | LED2.C LED1.C 31.75,14.82 34.29,12.29 v34.29,10.16 | 36.83,31.11 36.83,33.02 38.73,34.92 v40.01,34.92 | C9.2 40.33,32.7 v40.64,32.38 | X4.3 16.51,52.7 21.27,47.94 C2.2 21.27,42.87 20.95,42.55 20.95,41.07 D1.A
  Top 0.508: X5.2 8.26,6.35 8.57,6.04 C6.2 10.16,5.08 10.79,4.45 12.38,4.45 C1.2 14.29,4.76 15.24,5.71 R3.1 15.24,6.35 16.51,5.08 20.32,5.08 20.95,5.71 | 19.68,60.96 13.34,60.96 X4.1 12.7,55.24 X4.3 6.86,52.7 | IC06.1 29.57,61.98 | 29.57,62.23 29.57,62.51 29.21,62.87 20.95,62.87 20,61.91 C5.1 | v42.55,20.32 42.06,20.8 40.64,20.8 | v34.29,10.16 27.3,10.16 SPANNUNGOPV.2 27.3,8.26 24.77,5.71 20.95,5.71 | 6.86,52.7 6.22,52.7 5.65,52.13 | 5.65,52.13 5.33,51.82 | 5.33,51.82 5.02,51.5 | 5.02,51.5 2.54,49.02 2.54,29.21 3.81,27.94 X2.2 | 5.71,51.56 5.71,52.07 5.65,52.13 | 5.71,51.56 5.71,50.8 | 5.71,51.56 6.86,52.7 | 5.71,50.8 5.33,51.18 | 5.33,51.18 5.33,51.82 | 5.33,51.18 5.02,51.5 | 5.71,50.8 GNDOUT.1 | 20.95,5.71 IC2.11 | D2.A 47.2,5.92 v47.62,6.35
  Bottom 0.305: BME680GND.1 X2.2 | X3.2 7.62,15.88 | 8.13,15.88 8.26,15.88 8,16.13 | 7.94,15.56 7.62,15.88 | 7.94,15.56 8.13,15.37 | 8.26,15.24 8.13,15.37 | 8.13,15.37 8.13,15.62 | 8.13,15.62 8.13,15.75 | 8.13,15.88 8.13,15.75 | 8.13,15.75 7.94,15.56 | 8.26,15.37 7.75,15.88 | 7.75,15.88 7.87,15.88 | 7.87,15.88 7.94,15.81 | 7.94,15.81 8.13,15.62 | 8.06,15.88 7.87,15.88 | 7.62,15.88 7.75,15.88 | 7.75,15.88 7.94,16.07 | 8.26,16.38 8,16.13 | 8,16.13 7.94,16.07 | 7.94,16.07 7.94,16 | 7.94,16 7.94,15.81 | 8.13,15.88 8.06,15.88 | 8.06,15.88 7.94,16 | 8,16.13 8.26,16.13 | 7.62,15.88 8.26,16.51 | v40.64,32.38 40.64,22.23 v42.55,20.32 | v40.01,34.92 41.91,34.92
  Bottom 0.508: X5.2 7.62,6.35 8.26,6.99 8.26,15.24 8.26,15.37 8.26,15.88 8.26,16.13 8.26,16.38 8.26,16.51 8.26,21.59 6.35,23.5 4.45,23.5 3.17,24.77 3.17,27.3 3.81,27.94 X2.2 | v34.29,10.16 39.37,10.16 42.55,13.34 v42.55,20.32 45.09,20.32 49.53,15.88 BDM.2 52.07,10.79 v47.62,6.35
  pour Bottom: 41.91,22.86 41.91,38.1 42.55,38.73 48.26,38.73 48.9,38.1 48.9,22.86 48.26,22.23 42.55,22.23
LEDGREEN
  Top 0.254: IC1.9 28.19,23.25 30.48,20.95
  Top 0.305: 30.48,20.95 R2.1
LEDRED
  Top 0.254: IC1.8 27.69,20.89
  Top 0.305: 27.69,20.89 R4.1
N$2
  Top 0.305: 13.02,11.11 R1.1 13.02,11.43 15.24,11.43 | IC2.10 19.68,10.79 19.05,11.43 15.24,11.43 | R3.2 15.24,11.43
N$3
  Top 0.305: X5.1 3.81,3.81 3.17,4.45 3.17,9.53 3.81,10.16 10.48,10.16 11.43,9.21 R1.2 C1.1
  Bottom 0.305: AIN.1 8.89,3.17 8.26,3.81 X5.1
N$4
  Top 0.305: R6.2 X6.2
N$6
  Top 0.305: R11.1 X6.1
N$7
  Top 0.305: 20.95,15.24 25.4,15.24 27.3,13.34 SPANNUNGOPV.1 | IC2.4 20.95,15.24 | 20.95,15.24 15.55,15.24 R28.1
N$9
  Top 0.305: R2.2 LED1.A
N$10
  Top 0.305: R8.2 X3.4
N$11
  Top 0.305: X3.3 R7.2
N$12
  Top 0.305: R4.2 LED2.A
N$21  (via drill 0.35)
  Top 0.305: v18.41,10.16 IC2.9 v18.41,6.35 17.78,6.35 17.14,6.99 IC2.8 | R27.1 v29.84,38.73
  Bottom 0.305: v18.41,6.35 AOUT.1 | v18.41,10.16 18.41,12.7 22.86,17.14 22.86,23.5 27.3,27.94 28.57,27.94 30.48,29.84 30.48,36.83 29.84,37.47 v29.84,38.73
N$71
  Top 0.508: X4.2 15.88,56.52 19.05,53.34 D3.A
  Bottom 0.508: 12VIN.1 8.26,52.07 13.97,57.78 X4.2
PTB3  (via drill 0.35)
  Top 0.254: IC1.26 31.14,31.23 30.5,30.59 26.55,30.59
  Top 0.305: 26.55,30.59 24.13,33.02 24.13,34.29 20.32,38.1 v18.41,38.1
  Bottom 0.305: X2.6 BME680CS.1 v18.41,38.1
PTC0  (via drill 0.35)
  Top 0.254: IC1.31 35,33.73
  Top 0.305: 35,33.73 36.83,35.56 v36.83,39.37
  Bottom 0.305: v36.83,39.37 36.83,51.44 40.01,54.61 X1.6
PTC1  (via drill 0.35)
  Top 0.254: IC1.32 33.68,34.95
  Top 0.305: 33.68,34.95 35.56,36.83 v35.56,39.37
  Bottom 0.305: v35.56,39.37 35.56,52.7 37.47,54.61 X1.7
RESET
  Top 0.254: IC1.25 35.17,30.73 35.56,31.11
  Top 0.305: R17.1 49.53,17.14 | 49.53,17.14 50.16,17.14 51.44,18.41 BDM.4 52.7,18.41 53.34,19.05 53.34,34.29 48.9,38.73 41.27,38.73 35.56,33.02 35.56,31.11 | C11.1 49.53,13.02 49.53,17.14
SCL0/MOSI  (via drill 0.35)
  Top 0.254: IC1.28 30.64,32.23
  Top 0.305: 30.64,32.23 29.84,33.02 v26.67,33.02 | v26.67,40.64 v38.1,40.64
  Bottom 0.305: X2.4 BME680SDA.1 v26.67,33.02 v26.67,40.64 | v38.1,40.64 38.73,40.64 47.62,49.53 X1.3
SDA0/MISO  (via drill 0.35)
  Top 0.254: IC1.27 26.69,31.73
  Top 0.305: 26.69,31.73 25.4,33.02 v25.4,34.29 | v25.4,41.91 26.67,43.18 v38.1,43.18
  Bottom 0.305: X2.5 BME680SDO.1 22.86,35.56 24.13,34.29 v25.4,34.29 v25.4,41.91 | v38.1,43.18 38.73,43.18 42.55,46.99 X1.5
SPSCK0  (via drill 0.35)
  Top 0.254: IC1.29 31.41,32.73
  Top 0.305: 31.41,32.73 29.84,34.29 v27.94,34.29 | v38.1,41.91 v27.94,41.91
  Bottom 0.305: X2.3 BME680SCL.1 13.34,31.11 18.41,31.11 19.05,30.48 25.4,30.48 27.94,33.02 v27.94,34.29 v27.94,41.91 | v38.1,41.91 38.73,41.91 45.09,48.26 X1.4
SS0  (via drill 0.35)
  Top 0.254: IC1.30 32.17,33.23
  Top 0.305: 32.17,33.23 31.75,33.66 31.75,34.29 33.02,35.56 v33.02,39.37
  Bottom 0.305: X1.8 34.92,53.98 33.02,52.07 v33.02,39.37
WATERPRESSURESENSOR
  Top 0.254: IC1.43 26.69,38.4
  Top 0.305: 26.69,38.4 R27.2 24.77,38.73 23.93,39.58 D1.C 23.5,41.07 23.5,43.18 C2.1
XTAL
  Top 0.254: IC1.22 37.45,29.23
  Top 0.305: Q2.2 45.02,33.98 C3.1 R10.2 41.59,31.43 41.27,31.11 41.27,29.84 40.01,28.57 38.1,28.57 37.45,29.23

### Text on the board
tPlace: DOOR | BME680 | FSS / Auer Andreas / 5C EL / TFO-Meran | TEMP | WATER
bPlace: FSS / Andreas Auer / 2021 / TFO-Meran | C:/Users/Kneidl/OneDrive - Bildungsdirektion/Andreas/Oberschule/5. Oberschule 202122/Maturaprjoct/drawing/Logo/FSSLOGOCut_BW.bmp
tNames: SS | +3V3 | GND | MISO | SPSCK | MOSI | DIN | +3V3 | SS | MISO | MOSI | SPSCK | GND | +3V3 | SCL0 | SDA0 | GND | +3V3 | +5V | GND | AIN